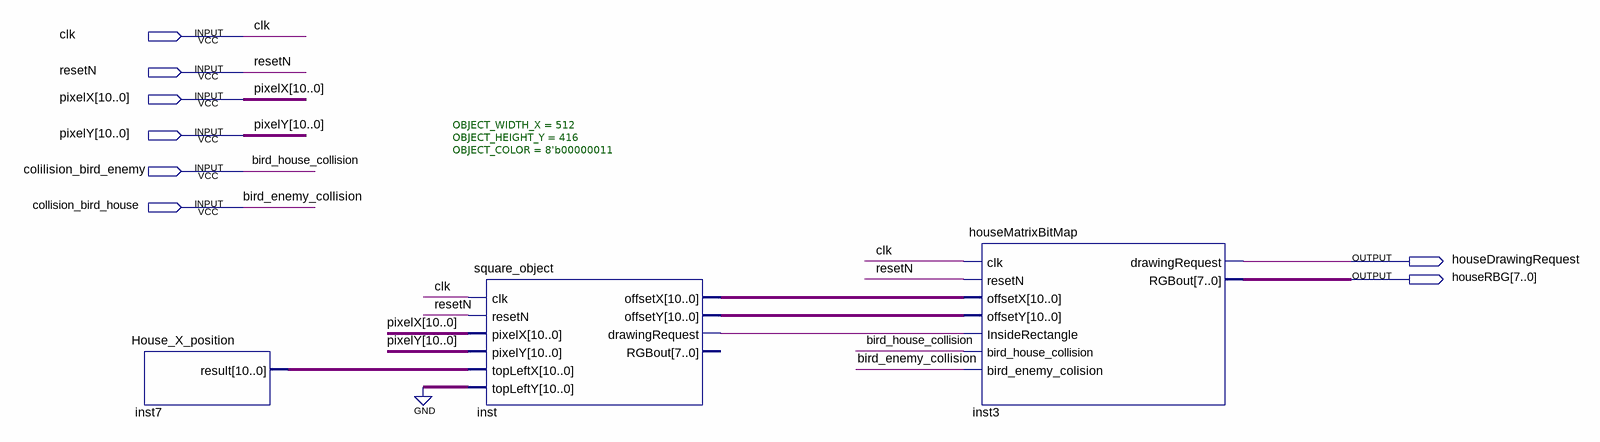
[diagram p0: schematic sheet]
// Quartus schematic House_Block_T.bdf as structural Verilog: 3 symbols, 8 pins
module House_Block_T (
  input  clk,
  input  resetN,
  input  [10:0] pixelX,
  input  [10:0] pixelY,
  input  colilision_bird_enemy,
  input  collision_bird_house,
  output houseDrawingRequest,
  output [7:0] houseRBG
);

  wire inst_drawingrequest;
  wire [10:0] inst7_result, inst_offsetx, inst_offsety;

  House_X_position inst7 (.result(inst7_result));
  square_object #(.OBJECT_WIDTH_X(512), .OBJECT_HEIGHT_Y(416), .OBJECT_COLOR(8'b00000011)) inst (
    .clk(clk), .resetN(resetN), .pixelX(pixelX), .pixelY(pixelY), .topLeftX(inst7_result),
    .topLeftY({11{1'b0}}), .offsetX(inst_offsetx), .offsetY(inst_offsety),
    .drawingRequest(inst_drawingrequest));  // open: RGBout
  houseMatrixBitMap inst3 (
    .clk(clk), .resetN(resetN), .offsetX(inst_offsetx), .offsetY(inst_offsety),
    .InsideRectangle(inst_drawingrequest), .bird_house_collision(colilision_bird_enemy),
    .bird_enemy_colision(collision_bird_house), .drawingRequest(houseDrawingRequest), .RGBout(houseRBG));

  // Other names for the same wires on the sheet: bird_enemy_collision = collision_bird_house;
  //   bird_house_collision = colilision_bird_enemy
endmodule
